# Altium schematic sheet D_Output.SchDoc
size B; SheetNumber: 6; SheetTotal: 9
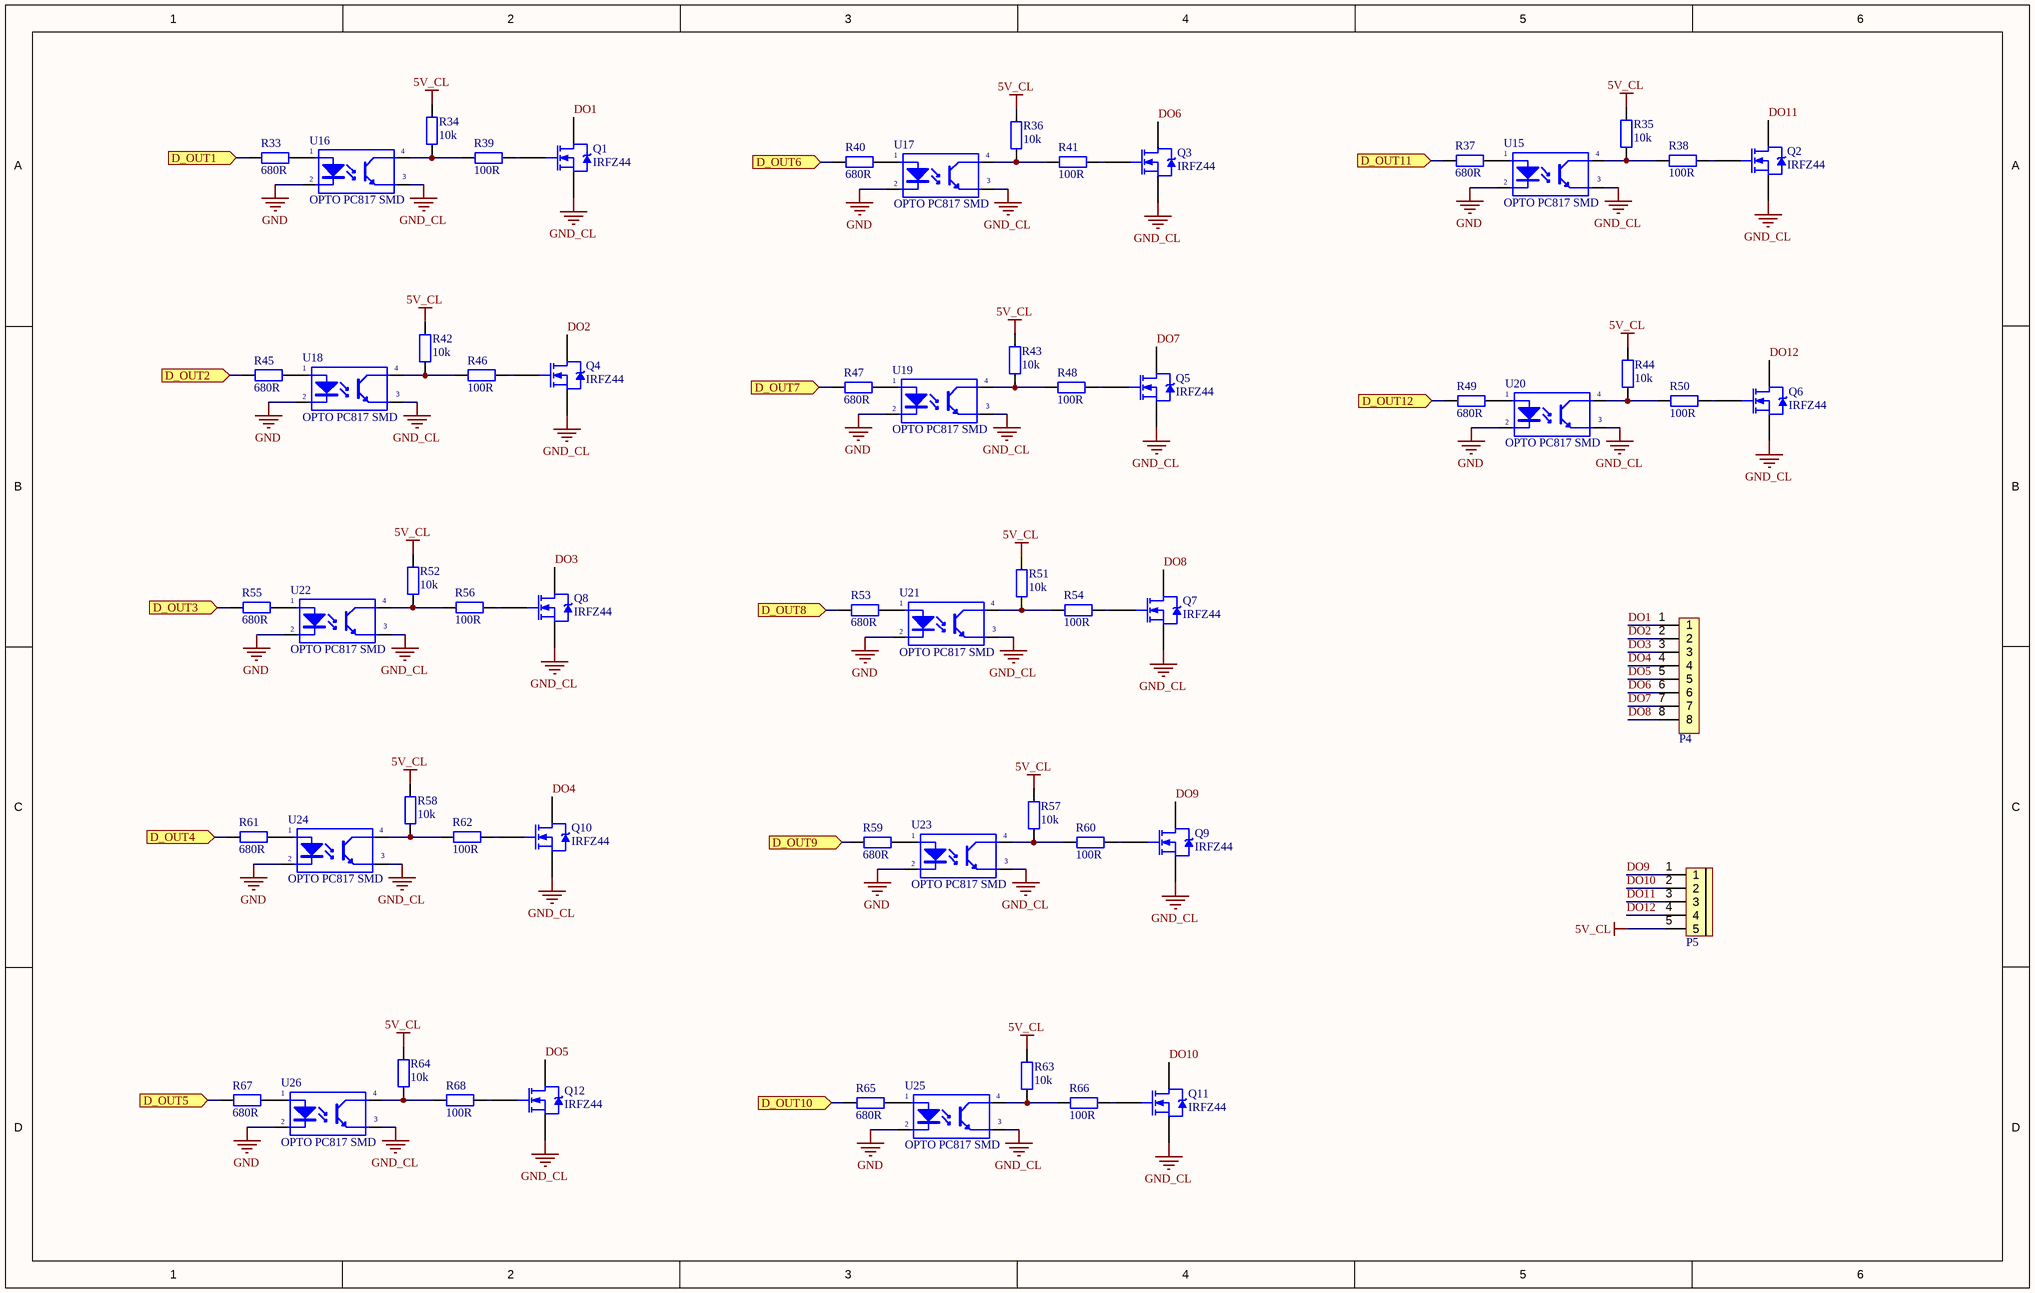
[diagram p0: D_Output.SchDoc]

## Parts
P4  CON 8 EDG5.08  [CON 8 8EDG5.08]  (value not drawn)
P5  CON 5 EDG5.08  [CON 5 5EDG5.08]  (value not drawn)
Q1  IRFZ44  [TO220]
Q2  IRFZ44  [TO220]
Q3  IRFZ44  [TO220]
Q4  IRFZ44  [TO220]
Q5  IRFZ44  [TO220]
Q6  IRFZ44  [TO220]
Q7  IRFZ44  [TO220]
Q8  IRFZ44  [TO220]
Q9  IRFZ44  [TO220]
Q10  IRFZ44  [TO220]
Q11  IRFZ44  [TO220]
Q12  IRFZ44  [TO220]
R33  680R  [tro smd 0805]
R34  10k  [tro smd 0805]
R35  10k  [tro smd 0805]
R36  10k  [tro smd 0805]
R37  680R  [tro smd 0805]
R38  100R  [tro smd 0805]
R39  100R  [tro smd 0805]
R40  680R  [tro smd 0805]
R41  100R  [tro smd 0805]
R42  10k  [tro smd 0805]
R43  10k  [tro smd 0805]
R44  10k  [tro smd 0805]
R45  680R  [tro smd 0805]
R46  100R  [tro smd 0805]
R47  680R  [tro smd 0805]
R48  100R  [tro smd 0805]
R49  680R  [tro smd 0805]
R50  100R  [tro smd 0805]
R51  10k  [tro smd 0805]
R52  10k  [tro smd 0805]
R53  680R  [tro smd 0805]
R54  100R  [tro smd 0805]
R55  680R  [tro smd 0805]
R56  100R  [tro smd 0805]
R57  10k  [tro smd 0805]
R58  10k  [tro smd 0805]
R59  680R  [tro smd 0805]
R60  100R  [tro smd 0805]
R61  680R  [tro smd 0805]
R62  100R  [tro smd 0805]
R63  10k  [tro smd 0805]
R64  10k  [tro smd 0805]
R65  680R  [tro smd 0805]
R66  100R  [tro smd 0805]
R67  680R  [tro smd 0805]
R68  100R  [tro smd 0805]
U15  OPTO PC817 SMD  [SOP4]
U16  OPTO PC817 SMD  [SOP4]
U17  OPTO PC817 SMD  [SOP4]
U18  OPTO PC817 SMD  [SOP4]
U19  OPTO PC817 SMD  [SOP4]
U20  OPTO PC817 SMD  [SOP4]
U21  OPTO PC817 SMD  [SOP4]
U22  OPTO PC817 SMD  [SOP4]
U23  OPTO PC817 SMD  [SOP4]
U24  OPTO PC817 SMD  [SOP4]
U25  OPTO PC817 SMD  [SOP4]
U26  OPTO PC817 SMD  [SOP4]

## Ports
D_OUT1 (in), D_OUT2 (in), D_OUT3 (in), D_OUT4 (in), D_OUT5 (in), D_OUT6 (in), D_OUT7 (in), D_OUT8 (in), D_OUT9 (in), D_OUT10 (in), D_OUT11 (in), D_OUT12 (in)

## Nets
5V_CL: P5.5 R34.1 R35.1 R36.1 R42.1 R43.1 R44.1 R51.1 R52.1 R57.1 R58.1 R63.1 R64.1
GND: U15.2(K) U16.2(K) U17.2(K) U18.2(K) U19.2(K) U20.2(K) U21.2(K) U22.2(K) U23.2(K) U24.2(K) U25.2(K) U26.2(K)
GND_CL: Q1.3(S) Q2.3(S) Q3.3(S) Q4.3(S) Q5.3(S) Q6.3(S) Q7.3(S) Q8.3(S) Q9.3(S) Q10.3(S) Q11.3(S) Q12.3(S) U15.3(E) U16.3(E) U17.3(E) U18.3(E) U19.3(E) U20.3(E) U21.3(E) U22.3(E) U23.3(E) U24.3(E) U25.3(E) U26.3(E)
D_OUT1: R33.1 ; port D_OUT1
D_OUT2: R45.1 ; port D_OUT2
D_OUT3: R55.1 ; port D_OUT3
D_OUT4: R61.1 ; port D_OUT4
D_OUT5: R67.1 ; port D_OUT5
D_OUT6: R40.1 ; port D_OUT6
D_OUT7: R47.1 ; port D_OUT7
D_OUT8: R53.1 ; port D_OUT8
D_OUT9: R59.1 ; port D_OUT9
D_OUT10: R65.1 ; port D_OUT10
D_OUT11: R37.1 ; port D_OUT11
D_OUT12: R49.1 ; port D_OUT12
DO1: P4.1 Q1.2(D)
DO2: P4.2 Q4.2(D)
DO3: P4.3 Q8.2(D)
DO4: P4.4 Q10.2(D)
DO5: P4.5 Q12.2(D)
DO6: P4.6 Q3.2(D)
DO7: P4.7 Q5.2(D)
DO8: P4.8 Q7.2(D)
DO9: P5.1 Q9.2(D)
DO10: P5.2 Q11.2(D)
DO11: P5.3 Q2.2(D)
DO12: P5.4 Q6.2(D)
NetQ1_1: Q1.1(G) R39.2
NetQ2_1: Q2.1(G) R38.2
NetQ3_1: Q3.1(G) R41.2
NetQ4_1: Q4.1(G) R46.2
NetQ5_1: Q5.1(G) R48.2
NetQ6_1: Q6.1(G) R50.2
NetQ7_1: Q7.1(G) R54.2
NetQ8_1: Q8.1(G) R56.2
NetQ9_1: Q9.1(G) R60.2
NetQ10_1: Q10.1(G) R62.2
NetQ11_1: Q11.1(G) R66.2
NetQ12_1: Q12.1(G) R68.2
NetR33_2: R33.2 U16.1(A)
NetR34_2: R34.2 R39.1 U16.4(C)
NetR35_2: R35.2 R38.1 U15.4(C)
NetR36_2: R36.2 R41.1 U17.4(C)
NetR37_2: R37.2 U15.1(A)
NetR40_2: R40.2 U17.1(A)
NetR42_2: R42.2 R46.1 U18.4(C)
NetR43_2: R43.2 R48.1 U19.4(C)
NetR44_2: R44.2 R50.1 U20.4(C)
NetR45_2: R45.2 U18.1(A)
NetR47_2: R47.2 U19.1(A)
NetR49_2: R49.2 U20.1(A)
NetR51_2: R51.2 R54.1 U21.4(C)
NetR52_2: R52.2 R56.1 U22.4(C)
NetR53_2: R53.2 U21.1(A)
NetR55_2: R55.2 U22.1(A)
NetR57_2: R57.2 R60.1 U23.4(C)
NetR58_2: R58.2 R62.1 U24.4(C)
NetR59_2: R59.2 U23.1(A)
NetR61_2: R61.2 U24.1(A)
NetR63_2: R63.2 R66.1 U25.4(C)
NetR64_2: R64.2 R68.1 U26.4(C)
NetR65_2: R65.2 U25.1(A)
NetR67_2: R67.2 U26.1(A)

## Notes on the sheet
- DWG. NO.
- REV.
- SHT.
- REVISION
- DESCRIPTION
- DATE
- APPROVED
- THIS DOCUMENT AND THE DATA DISCLOSED HEREIN OR HEREWITH IS THE PROPERTY OF ALTIUM LIMITED AND MAY BE FREELY DISTRIBUTED IN WHOLE. NO RIGHTS ARE RESERVED OR EXPRESS OR IMPLIED WARANTEE GIVEN.
- ENG:
- DSN:
- APPROVALS
- PROJECT
- DOCUMENT REVISION:
- DESIGN ITEM:
- CHK:
- BOM:
- REFERENCE DOCUMENTS
- PROJECT REVISION:
- TITLE
- FAB DWG:
- PCB DWG:
- ASSY DWG:
- SCALE:
- SIZE
- C
- CAGE CODE
- FILE NAME
- DWG NO.
- SHEET
- OF
- REV

## Library data of the parts
P4 = CON 8 EDG5.08: Cắm; Ten_Linh_Kien: CON 8 2EDG5.08-8P 5.08MM ( Xanh Cong); Ma_Hang: MH000978; Don_Vi: Con; Ghi_Chu: *; Kieu_Chan: *; Chung_Loai: Cắm
P5 = CON 5 EDG5.08: Cắm; Ten_Linh_Kien: CON 5 2EDG5.08-5P 5.08MM ( Xanh Cong); Ma_Hang: MH003589; Kieu_Chan: *; Don_Vi: Con; Ghi_Chu: *; Chung_Loai: Cắm
Q1-Q12 = IRFZ44 DIP: N-Channel Power MOSFET
R33 R37 R40 R45 R47 R49 R53 R55 R59 R61 R65 R67 = Tro 0805 1% 680R: Dán; Don_Vi: Con; So_Chan: 2; Ten_Linh_Kien: Trở 0805 1% 680R; Ma_Hang: MH005487; Chung_Loai: Dán; Kieu_Chan: *
R34-R36 R42-R44 R51 R52 R57 R58 R63 R64 = Tro 0805 1% 10k: Dán; Don_Vi: Con; So_Chan: 2; Ten_Linh_Kien: Trở 0805 1% 10k; Ma_Hang: MH005473; Chung_Loai: Dán; Kieu_Chan: *
R38 R39 R41 R46 R48 R50 R54 R56 R60 R62 R66 R68 = Tro 0805 5% 100R: Dán; Don_Vi: Con; So_Chan: 2; Ten_Linh_Kien: Trở 0805 5% 100R; Ma_Hang: MH005251; Chung_Loai: Dán; Kieu_Chan: *
U15-U26 = OPTO PC817 SMD: Single Opto; Value: PC817